# Altium schematic sheet BoardC-Power.SchDoc
size A; SheetNumber: 2; SheetTotal: 2
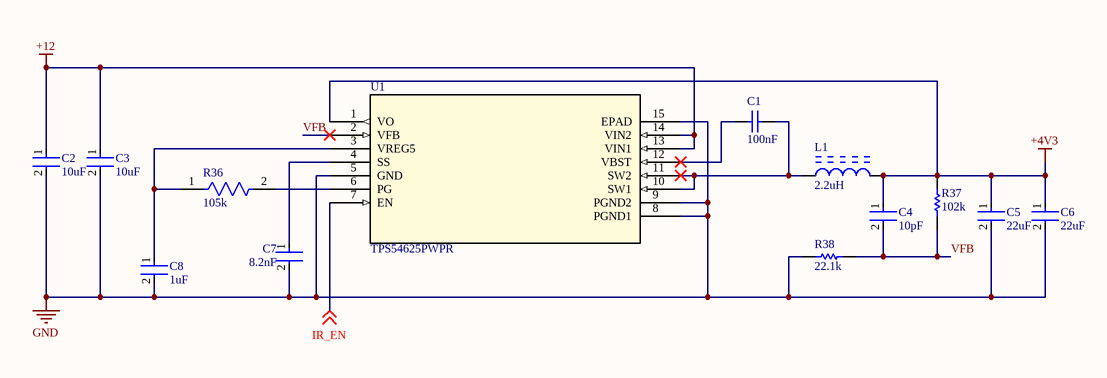
[diagram p0: BoardC-Power.SchDoc]

## Parts
C1  100nF  [SAMS-C0603-2_M]
C2  10uF  [FP-CL10-IPC_C]
C3  10uF  [FP-CL10-IPC_C]
C4  10pF  [FP-CL10-IPC_B]
C5  22uF  [FP-CL10-IPC_B]
C6  22uF  [FP-CL10-IPC_B]
C7  8.2nF  [FP-CL10-IPC_B]
C8  1uF  [FP-CL10-IPC_C]
L1  2.2uH  [BOUR-SRN6045_V]
R36  105k  [FP-CRCW0603-e3-IPC_B]
R37  102k  [RESC1609X50X30LL10T20]
R38  22.1k  [RESC1609X50X30LL10T20]
U1  TPS54625PWPR  [PWP14_2P31X2P46_TEX]

## Nets
+4V3: C4.1 C5.1 C6.1 L1.2 R37.2 U1.1(VO)
+12: C2.1 C3.1 U1.13(VIN1) U1.14(VIN2)
GND: C2.2 C3.2 C5.2 C6.2 C7.2 C8.2 R38.1 U1.5(GND) U1.8(PGND1) U1.9(PGND2) U1.15(EPAD)
IR_EN: U1.7(EN) ; off-sheet IR_EN
VFB: C4.2 R37.1 R38.2 U1.2(VFB)
NetC1_1: C1.1 U1.12(VBST)
NetC1_2: C1.2 L1.1 U1.10(SW1) U1.11(SW2)
NetC7_1: C7.1 U1.4(SS)
NetC8_1: C8.1 R36.1 U1.3(VREG5)
NetR36_2: R36.2 U1.6(PG)

## Library data of the parts
C1 = CMP-2000-05332-1: Multi-layer Ceramic Capacitor, -55 to 125 degC, 2-Pin SMD (0603), RoHS, Tape and Reel; Manufacturer: Samsung Electro-Mechanics; Capacitance: 0.1µF; Rated Voltage: 50V; Dielectric: X7R; Tolerance (%): ±10%; Case Size/Dimension: 0603; Datasheet URL: https://datasheet.ciiva.com/29198/456651-da-01-en-vs-kondensator-0605-29198839.pdf; Manufacturer URL: http://www.samsungsem.com/global/index.jsp; Datasheet Version: Nov-10
C2 C3 = CMP-13271-001938-1: Cap Ceramic 10uF 6.3V X5R ±20% Pad SMD 0603 +85°C T/R; Contact Plating: Tin; Height: 0.8mm; Width: 0.031inch; Min Operating Temperature: -55°C; Capacitance: 10uF; Dielectric: X5R; Voltage Rating: 6.3V; Case/Package: 0603; Package Quantity: 1; Radiation Hardening: No; Packaging: Tape and Reel; Max Operating Temperature: 85°C; Voltage: 6.3V; Thickness: 0.035inch; Mount: Surface Mount; Case Code (Imperial): 0603; Case Code (Metric): 1608; Depth: 0.8mm; Tolerance: 20%; Length: 1.6mm
C4 = CMP-13271-001771-1: Cap Ceramic 10pF 50V C0G ±0.25pF Pad SMD 0603 +125°C T/R; Temperature Coefficient: 300ppm/°C; Height: 0.8mm; Package Quantity: 1; Radiation Hardening: No; Voltage: 50V; Case/Package: 0603; Max Operating Temperature: 125°C; Material: Ceramic; Case Code (Metric): 1608; Depth: 0.8mm; Length: 1.6mm; Thickness: 0.035inch; Width: 0.031inch; Lead Free: Lead Free; Packaging: Tape and Reel; Mount: Surface Mount; Voltage Rating: 50V; Min Operating Temperature: -55°C; Dielectric: C0G; Capacitance: 10pF; Case Code (Imperial): 0603; Voltage Rating (DC): 50V
C5 C6 = CMP-13271-002755-1: Cap Ceramic 22uF 16V X5R ±20% Pad SMD 0603 +85°C T/R; Mount: Surface Mount; Packaging: Tape and Reel; Case Code (Imperial): 0603; Max Operating Temperature: 85°C; Capacitance: 22uF; Case/Package: 0603; Voltage Rating: 16V; Tolerance: 20%; Case Code (Metric): 1608; Min Operating Temperature: -55°C
C7 = CMP-2000-06097-2: Cap Ceramic 8.2nF 50V X7R ±10% Pad SMD 0603 +125°C T/R; Voltage Rating: 50V; Dielectric: X7R; Length: 1.6mm; Mount: Surface Mount; Lead Free: Lead Free; Width: 0.031inch; Series: CL; Case Code (Imperial): 0603; Capacitance: 8.2nF; Case/Package: 0603; RoHS Compliant: Yes; Package Quantity: 1; Material: Ceramic; Voltage: 50V; Voltage Rating (DC): 50V; Thickness: 0.035inch; Max Operating Temperature: 125°C; Height: 0.8mm; Min Operating Temperature: -55°C; Tolerance: 10%; Depth: 0.8mm; Radiation Hardening: No; Case Code (Metric): 1608; Packaging: Tape and Reel; Construction: Flat
C8 = CMP-13271-003399-1: Cap Ceramic 1uF 10V X5R ±10% Pad SMD 0603 +85°C T/R; Min Operating Temperature: -55°C; Max Operating Temperature: 85°C; Dielectric: X5R; Contact Plating: Tin; Height: 0.8mm; Voltage: 10V; Packaging: Tape and Reel; Voltage Rating: 10V; Capacitance: 1uF; Package Quantity: 1; Width: 0.031inch; Length: 1.6mm; Depth: 0.8mm; Case/Package: 0603; Case Code (Imperial): 0603; Thickness: 0.035inch; Radiation Hardening: No; Tolerance: 10%; Case Code (Metric): 1608; Mount: Surface Mount
L1 = CMP-2000-07142-1: Semi-Shielded Power Inductor, 2.2 uH, +/- 30%, 3.5 A, -40 to 125 degC, 2-Pin SMD, RoHS, Tape and Reel; Manufacturer: Bourns; Kits: SRN-LAB1-ND / -INDUCTORKIT; Other Names: SRN6045-2R2YCT; EDA / CAD Models: DownloadfromAcceleratedDesigns; Current Rating: 3.5A; 3D Model: SRN6045.stp; Q @ Freq: 15@7.96MHz; Frequency - Self Resonant: 35MHz; PCN Assembly/Origin: MagneticproductsOct/2013; Type: Wirewound; DC Resistance (DCR): 25.1mOhmMax; Product Training Modules: SRNSeries:Semi-ShieldedInductors; Frequency - Test: 100kHz; Inductance: 2.2µH; Online Catalog: SRNSeries; Material - Core: Ferrite; Current - Saturation: 6A; Size / Dimension: 0.236"Lx0.236"W(6.00mmx6.00mm); Operating Temperature: -40°C~125°C; Height - Seated (Max): 0.177"(4.50mm); Mounting Technology: SurfaceMount; Package Description: 2-Pin Surface Mounted Device, Body 6 x 6 mm; Series: SRN6045; Packaging: CutTape(CT); Mounting Type: SurfaceMount; Shielding: Shielded; Datasheet Version: 12/2014; Category: Inductors,Coils,Chokes; Datasheet URL: http://www.bourns.com/docs/Product-Datasheets/SRN6045.pdf; Standard Package: 1; Manufacturer URL: http://www.bourns.com/; Package Reference: SRN6045; RoHS Information: SRN6045SeriesMaterialDeclaration; Family: FixedInductors; Package / Case: Nonstandard; Tolerance: ±30%
R36 = CMP-2000-03832-2: RES Thick Film, 105kΩ, 1%, 0.1W, 100ppm/°C, 0603; Power Rating: 100mW; Working Voltage: 75V; Resistance: 105kR; Weight: 7.1E-05oz; Packaging: Tape and Reel; Height: 0.02inch; Composition: Thick Film; Min Operating Temperature: -55°C; Temperature Coefficient: 100ppm/°C; Depth: 0.85mm; Package Quantity: 10; Tolerance: 1%; Voltage Rating (DC): 75V; Case Code (Metric): 1608; Voltage Rating: 75V; Termination: SMD/SMT; Contact Plating: Tin; Max Power Dissipation: 100mW; Number of Terminations: 2; Width: 0.85mm; Lead Free: Lead Free; Length: 1.55mm; Number of Pins: 2; Military Standard: Not; Radiation Hardening: No; Case Code (Imperial): 0603; Max Operating Temperature: 155°C; Case/Package: 0603; Features: Automotive AEC-Q200
R37 = CMP-2000-03830-1: Part Number: CRCW0603102KFKEA; Manufacturer: Vishay Dale
R38 = CMP-2000-03094-1: Part Number: CRCW060322K1FKEA; Manufacturer: Vishay Dale
U1 = TPS54625PWPR: No Description Available; Vendor: Texas Instruments; Built_By: EMA_UL_Team; SourceLibrary: TI_2016-07-22; Manufacturer_Part_Number: TPS54625PWPR; Copyright: Copyright (C) 2021 Accelerated Designs. All rights reserved; RefDes: RefDes; Type: DEV